# EAGLE design fullboard (EAGLE 9.5.1)

## Sheet 1 of 4: MCU
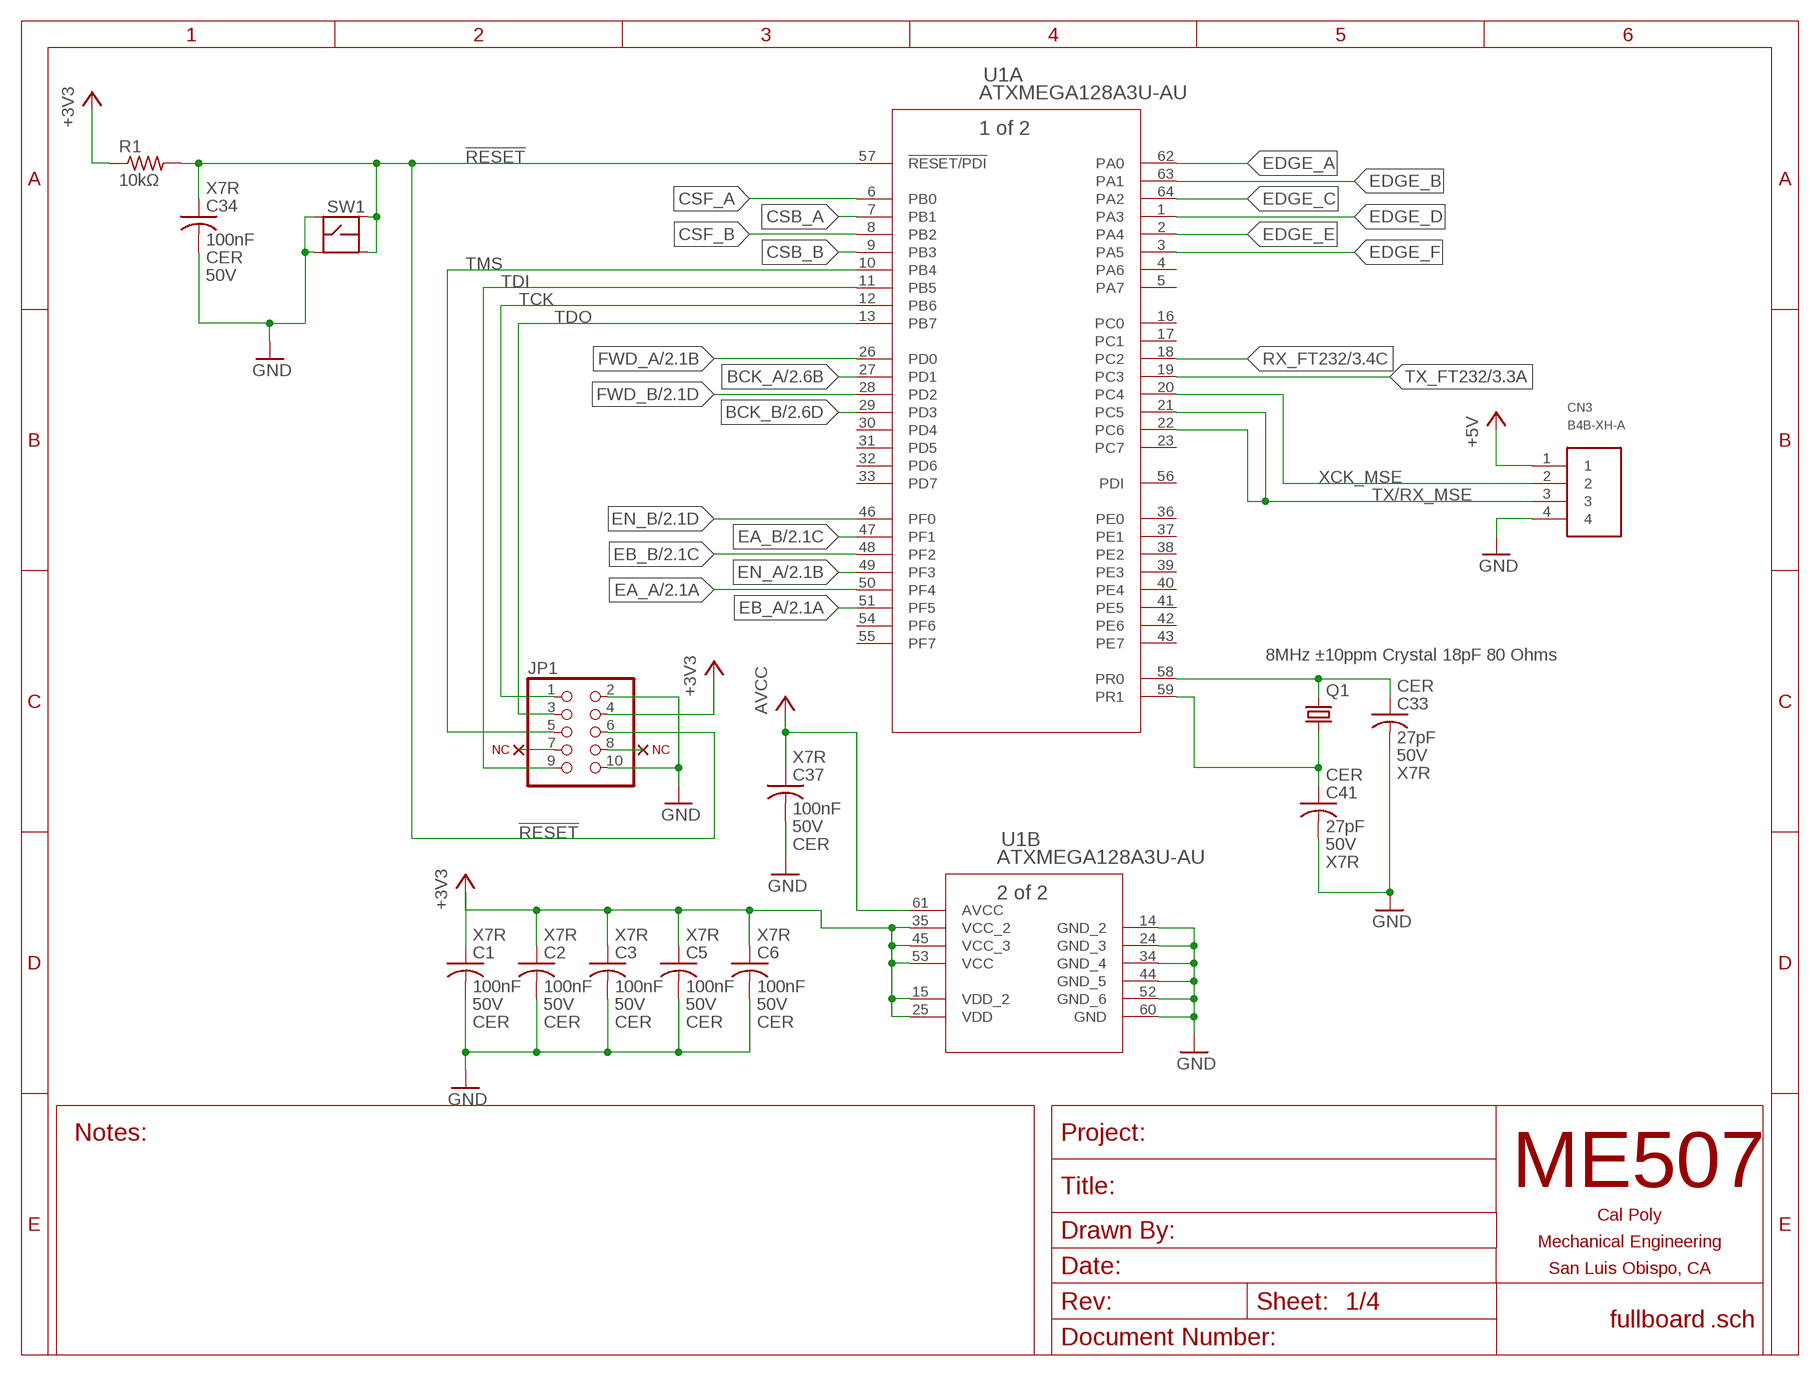
[diagram p0: schematic, sheet 1]

### Parts
C1  100nF  C-USC0805  [C0805]
C2  100nF  C-USC0805  [C0805]
C3  100nF  C-USC0805  [C0805]
C5  100nF  C-USC0805  [C0805]
C6  100nF  C-USC0805  [C0805]
C33  27pF  C-USC0805  [C0805]
C34  100nF  C-USC0805  [C0805]
C37  100nF  C-USC0805  [C0805]
C41  27pF  C-USC0805  [C0805]
CN3  B4B-XH-A  [B4B-XH-A]
JP1  PINHD-2X5  [2X05]
Q1  8MHz ±10ppm Crystal 18pF 80 Ohms  CRYSTALHC49UP  [HC49UP]
R1  10kΩ  R-US_R0805  [R0805]
SW1  TR1-SPST  [TR1]
U1  ATXMEGA128A3U-AU  [64A]
U$1  NC  (no package)
U$2  NC  (no package)

### Nets
!RESET: C34.1 JP1.6 R1.2 SW1.3 SW1.4 U1.57(A:!RESET/PDI)
+3V3: C1.1 C2.1 C3.1 C5.1 C6.1 JP1.4 R1.1 U1.15(B:VDD_2) U1.25(B:VDD) U1.35(B:VCC_2) U1.45(B:VCC_3) U1.53(B:VCC) ; also sheet 2,4
+5V: CN3.1 ; also sheet 4
AVCC: C37.1 U1.61(B:AVCC) ; also sheet 4
BCK_A: U1.27(A:PD1) ; also sheet 2
BCK_B: U1.29(A:PD3) ; also sheet 2
CSB_A: U1.7(A:PB1)
CSB_B: U1.9(A:PB3)
CSF_A: U1.6(A:PB0)
CSF_B: U1.8(A:PB2)
EA_A: U1.50(A:PF4) ; also sheet 2
EA_B: U1.47(A:PF1) ; also sheet 2
EB_A: U1.51(A:PF5) ; also sheet 2
EB_B: U1.48(A:PF2) ; also sheet 2
EDGE_A: U1.62(A:PA0)
EDGE_B: U1.63(A:PA1)
EDGE_C: U1.64(A:PA2)
EDGE_D: U1.1(A:PA3)
EDGE_E: U1.2(A:PA4)
EDGE_F: U1.3(A:PA5)
EN_A: U1.49(A:PF3) ; also sheet 2
EN_B: U1.46(A:PF0) ; also sheet 2
FWD_A: U1.26(A:PD0) ; also sheet 2
FWD_B: U1.28(A:PD2) ; also sheet 2
GND: C1.2 C2.2 C3.2 C5.2 C6.2 C33.2 C34.2 C37.2 C41.2 CN3.4 JP1.2 JP1.10 SW1.1 SW1.2 U1.14(B:GND_2) U1.24(B:GND_3) U1.34(B:GND_4) U1.44(B:GND_5) U1.52(B:GND_6) U1.60(B:GND) ; also sheet 2,3,4
N$6: JP1.7 U$2.D
N$7: JP1.8 U$1.D
RX_FT232: U1.18(A:PC2) ; also sheet 3
TCK: JP1.1 U1.12(A:PB6)
TDI: JP1.9 U1.11(A:PB5)
TDO: JP1.3 U1.13(A:PB7)
TMS: JP1.5 U1.10(A:PB4)
TX/RX_MSE: CN3.3 U1.21(A:PC5) U1.22(A:PC6)
TX_FT232: U1.19(A:PC3) ; also sheet 3
XCK_MSE: CN3.2 U1.20(A:PC4)
XTAL1: C41.1 Q1.2 U1.59(A:PR1)
XTAL2: C33.1 Q1.1 U1.58(A:PR0)
Unconnected: U1.4(A:PA6) U1.5(A:PA7) U1.16(A:PC0) U1.17(A:PC1) U1.23(A:PC7) U1.30(A:PD4) U1.31(A:PD5) U1.32(A:PD6) U1.33(A:PD7) U1.36(A:PE0) U1.37(A:PE1) U1.38(A:PE2) U1.39(A:PE3) U1.40(A:PE4) U1.41(A:PE5) U1.42(A:PE6) U1.43(A:PE7) U1.54(A:PF6) U1.55(A:PF7) U1.56(A:PDI)

## Sheet 2 of 4: Motor drivers
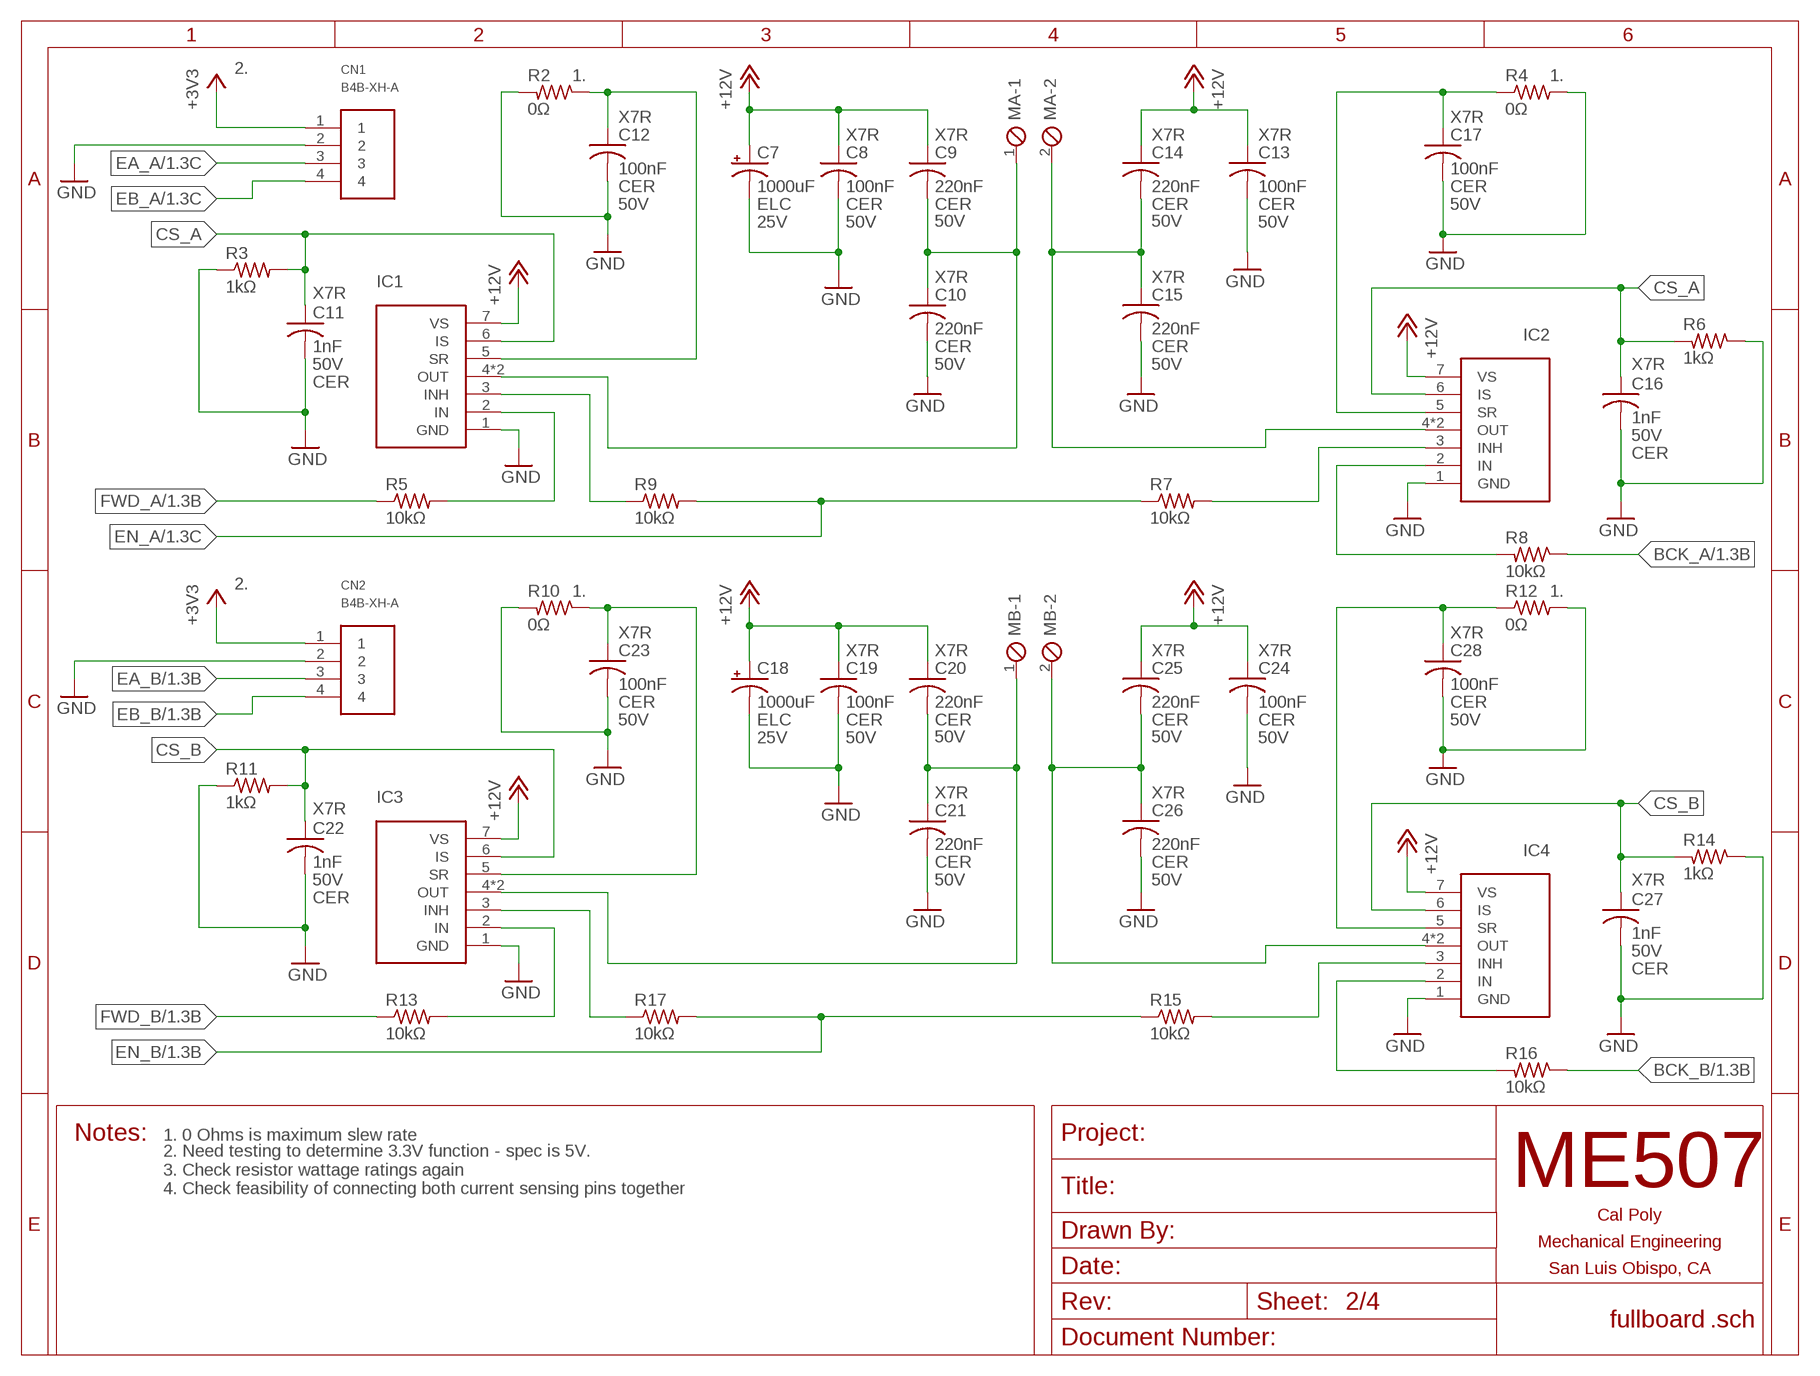
[diagram p1: schematic, sheet 2]
FRAME2 (TITLEBLOCK_LET_L): NOTES: 1. 0 Ohms is maximum slew rate

### Parts
C7  1000uF  CPOL-US  [E5-10]
C8  100nF  C-USC0805  [C0805]
C9  220nF  C-USC0805  [C0805]
C10  220nF  C-USC0805  [C0805]
C11  1nF  C-USC0805  [C0805]
C12  100nF  C-USC0805  [C0805]
C13  100nF  C-USC0805  [C0805]
C14  220nF  C-USC0805  [C0805]
C15  220nF  C-USC0805  [C0805]
C16  1nF  C-USC0805  [C0805]
C17  100nF  C-USC0805  [C0805]
C18  1000uF  CPOL-US  [E5-10]
C19  100nF  C-USC0805  [C0805]
C20  220nF  C-USC0805  [C0805]
C21  220nF  C-USC0805  [C0805]
C22  1nF  C-USC0805  [C0805]
C23  100nF  C-USC0805  [C0805]
C24  100nF  C-USC0805  [C0805]
C25  220nF  C-USC0805  [C0805]
C26  220nF  C-USC0805  [C0805]
C27  1nF  C-USC0805  [C0805]
C28  100nF  C-USC0805  [C0805]
CN1  B4B-XH-A  [B4B-XH-A]
CN2  B4B-XH-A  [B4B-XH-A]
IC1  IFX007T  [TO127P1500X440-7N]
IC2  IFX007T  [TO127P1500X440-7N]
IC3  IFX007T  [TO127P1500X440-7N]
IC4  IFX007T  [TO127P1500X440-7N]
MA  SCREWTERM_2P_508  [2POL508]
MB  SCREWTERM_2P_508  [2POL508]
R2  0Ω  R-US_R0805  [R0805]
R3  1kΩ  R-US_R0805  [R0805]
R4  0Ω  R-US_R0805  [R0805]
R5  10kΩ  R-US_R0805  [R0805]
R6  1kΩ  R-US_R0805  [R0805]
R7  10kΩ  R-US_R0805  [R0805]
R8  10kΩ  R-US_R0805  [R0805]
R9  10kΩ  R-US_R0805  [R0805]
R10  0Ω  R-US_R0805  [R0805]
R11  1kΩ  R-US_R0805  [R0805]
R12  0Ω  R-US_R0805  [R0805]
R13  10kΩ  R-US_R0805  [R0805]
R14  1kΩ  R-US_R0805  [R0805]
R15  10kΩ  R-US_R0805  [R0805]
R16  10kΩ  R-US_R0805  [R0805]
R17  10kΩ  R-US_R0805  [R0805]

### Nets
+3V3: CN1.1 CN2.1 ; also sheet 1,4
+12V: C7.+ C8.1 C9.1 C13.1 C14.1 C18.+ C19.1 C20.1 C24.1 C25.1 IC1.7(VS) IC2.7(VS) IC3.7(VS) IC4.7(VS) ; also sheet 4
BCK_A: R8.1 ; also sheet 1
BCK_B: R16.1 ; also sheet 1
CS_A: C11.1 C16.1 IC1.6(IS) IC2.6(IS) R3.2 R6.2
CS_B: C22.1 C27.1 IC3.6(IS) IC4.6(IS) R11.2 R14.2
EA_A: CN1.3 ; also sheet 1
EA_B: CN2.3 ; also sheet 1
EB_A: CN1.4 ; also sheet 1
EB_B: CN2.4 ; also sheet 1
EN_A: R7.1 R9.2 ; also sheet 1
EN_B: R15.1 R17.2 ; also sheet 1
FWD_A: R5.1 ; also sheet 1
FWD_B: R13.1 ; also sheet 1
GND: C7.- C8.2 C10.2 C11.2 C12.2 C13.2 C15.2 C16.2 C17.2 C18.- C19.2 C21.2 C22.2 C23.2 C24.2 C26.2 C27.2 C28.2 CN1.2 CN2.2 IC1.1(GND) IC2.1(GND) IC3.1(GND) IC4.1(GND) R2.2 R3.1 R4.2 R6.1 R10.2 R11.1 R12.2 R14.1 ; also sheet 1,3,4
MA_1: C9.2 C10.1 IC1.4(OUT) IC1.8(OUT) MA.1
MA_2: C14.2 C15.1 IC2.4(OUT) IC2.8(OUT) MA.2
MB_1: C20.2 C21.1 IC3.4(OUT) IC3.8(OUT) MB.1
MB_2: C25.2 C26.1 IC4.4(OUT) IC4.8(OUT) MB.2
N$2: C12.1 IC1.5(SR) R2.1
N$3: IC2.3(INH) R7.2
N$4: IC2.2(IN) R8.2
N$5: C17.1 IC2.5(SR) R4.1
N$9: IC1.2(IN) R5.2
N$10: C23.1 IC3.5(SR) R10.1
N$11: IC4.2(IN) R16.2
N$12: IC4.3(INH) R15.2
N$13: C28.1 IC4.5(SR) R12.1
N$15: IC3.3(INH) R17.1
N$16: IC3.2(IN) R13.2
N$17: IC1.3(INH) R9.1

### Notes on the sheet
- 2.
- 1. | 1.
- 2.
- 1. | 1.
- 2. Need testing to determine 3.3V function - spec is 5V.
  3. Check resistor wattage ratings again
  4. Check feasibility of connecting both current sensing pins together

## Sheet 3 of 4: USB/UART
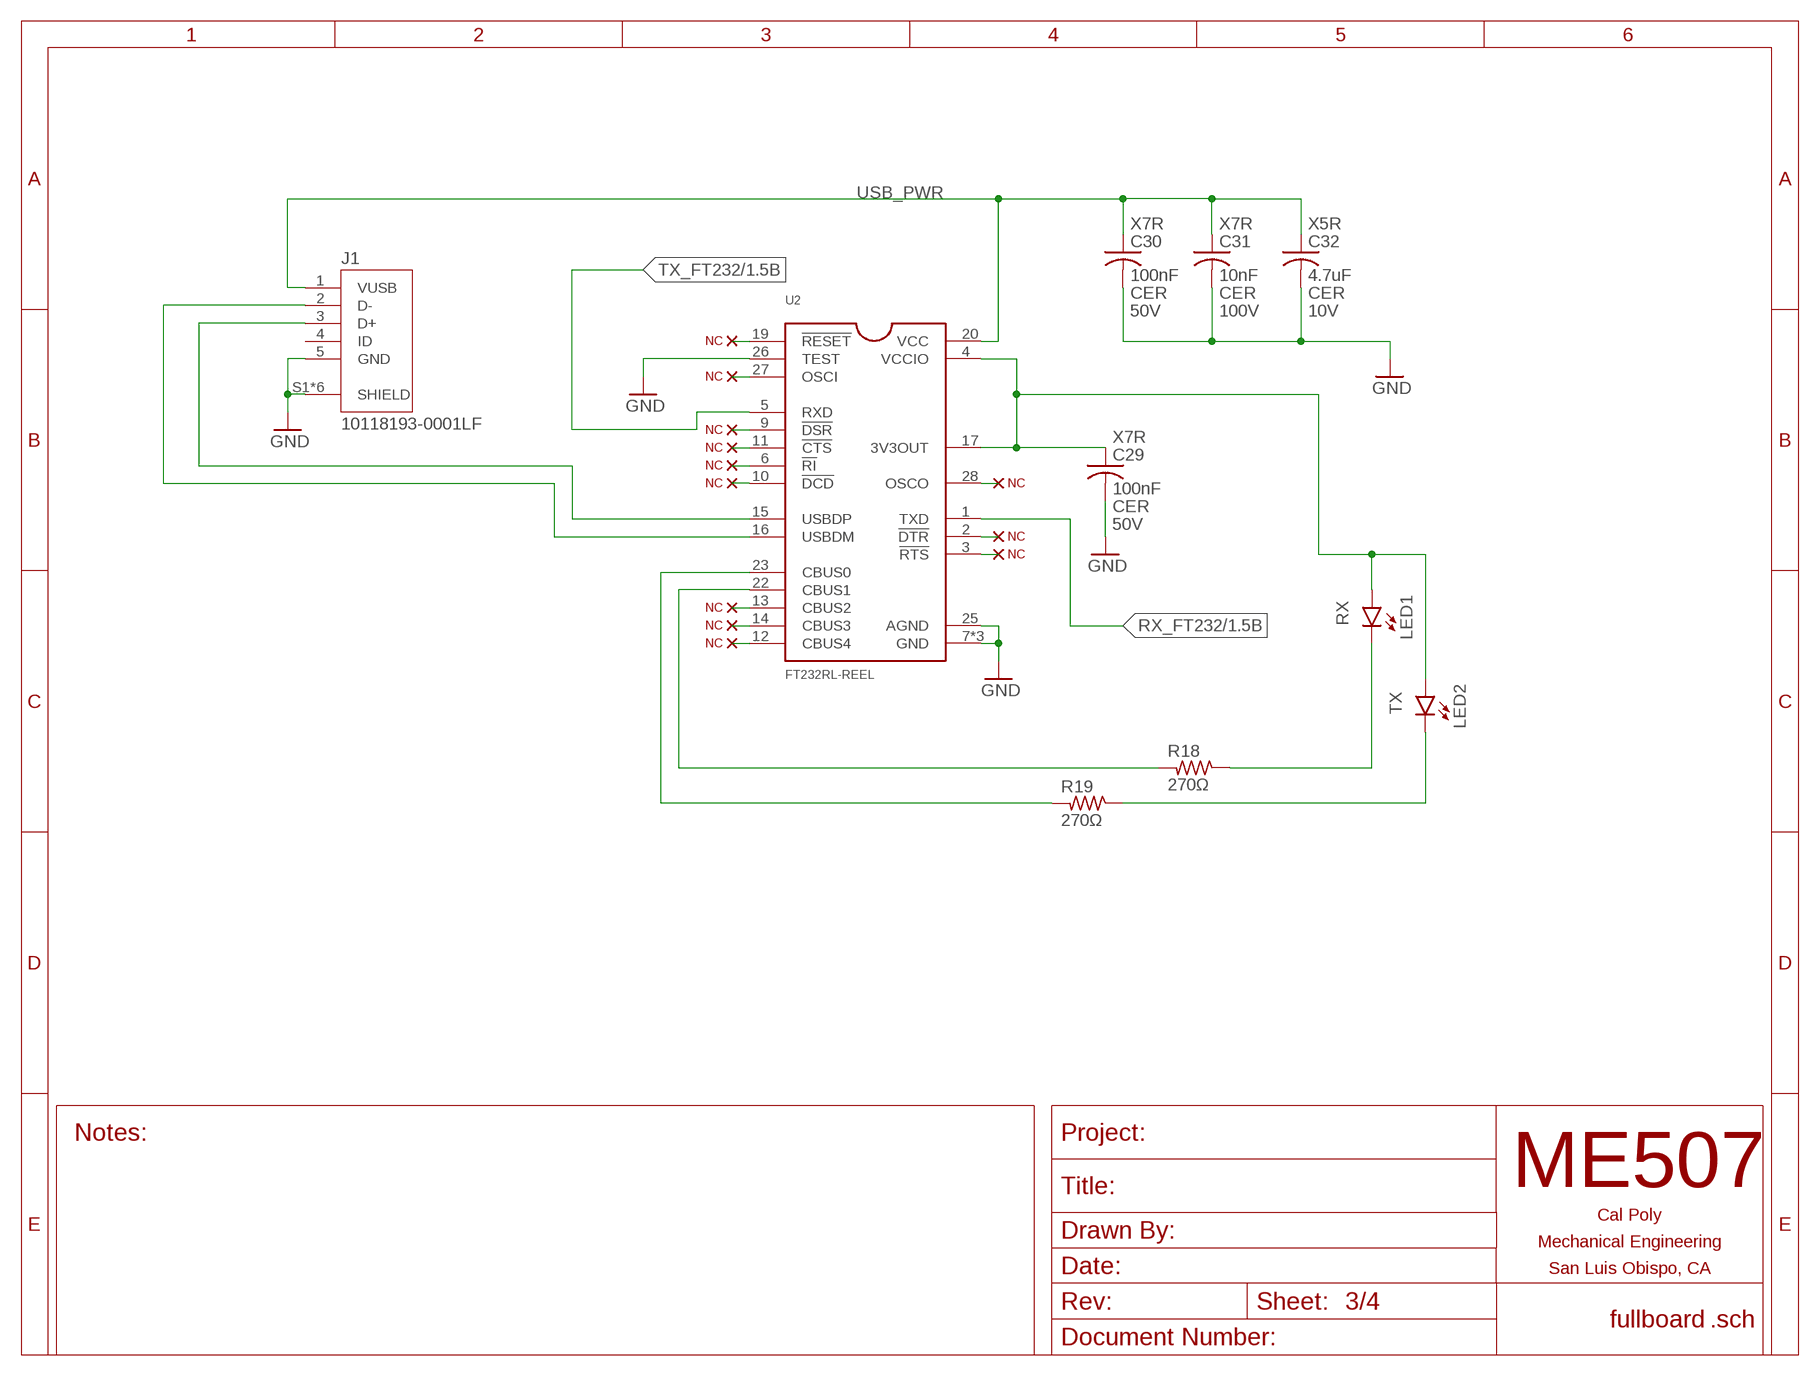
[diagram p2: schematic, sheet 3]

### Parts
C29  100nF  C-USC0805  [C0805]
C30  100nF  C-USC0805  [C0805]
C31  10nF  C-USC0805  [C0805]
C32  4.7uF  C-USC0805  [C0805]
J1  10118193-0001LF  [FCI_10118193-0001LF]
LED1  LEDSML0805  [SML0805]
LED2  LEDSML0805  [SML0805]
R18  270Ω  R-US_R0805  [R0805]
R19  270Ω  R-US_R0805  [R0805]
U2  FT232RL-REEL  [SOP65P780X200-28N]
U$3  NC  (no package)
U$4  NC  (no package)
U$5  NC  (no package)
U$6  NC  (no package)
U$7  NC  (no package)
U$8  NC  (no package)
U$9  NC  (no package)
U$10  NC  (no package)
U$11  NC  (no package)
U$12  NC  (no package)
U$13  NC  (no package)
U$14  NC  (no package)

### Nets
GND: C29.2 C30.2 C31.2 C32.2 J1.5(GND) J1.S1(SHIELD) J1.S2(SHIELD) J1.S3(SHIELD) J1.S4(SHIELD) J1.S5(SHIELD) J1.S6(SHIELD) U2.7(GND) U2.18(GND) U2.21(GND) U2.25(AGND) U2.26(TEST) ; also sheet 1,2,4
N$18: J1.2(D-) U2.16(USBDM)
N$19: J1.3(D+) U2.15(USBDP)
N$20: LED2.C R19.1
N$21: R19.2 U2.23(CBUS0)
N$22: R18.2 U2.22(CBUS1)
N$23: LED1.C R18.1
N$24: U2.27(OSCI) U$13.D
N$25: U2.9(!DSR) U$9.D
N$26: U2.11(!CTS) U$10.D
N$27: U2.28(OSCO) U$3.D
N$28: U2.2(!DTR) U$4.D
N$29: U2.3(!RTS) U$5.D
N$30: U2.13(CBUS2) U$6.D
N$31: U2.14(CBUS3) U$7.D
N$32: U2.12(CBUS4) U$8.D
N$33: U2.6(!RI) U$11.D
N$34: U2.10(!DCD) U$12.D
N$35: U2.19(!RESET) U$14.D
RX_FT232: U2.1(TXD) ; also sheet 1
TX_FT232: U2.5(RXD) ; also sheet 1
USB_PWR: C30.1 C31.1 C32.1 J1.1(VUSB) U2.20(VCC)
VCCIO: C29.1 LED1.A LED2.A U2.4(VCCIO) U2.17(3V3OUT)
Unconnected: J1.4(ID)

## Sheet 4 of 4: Power
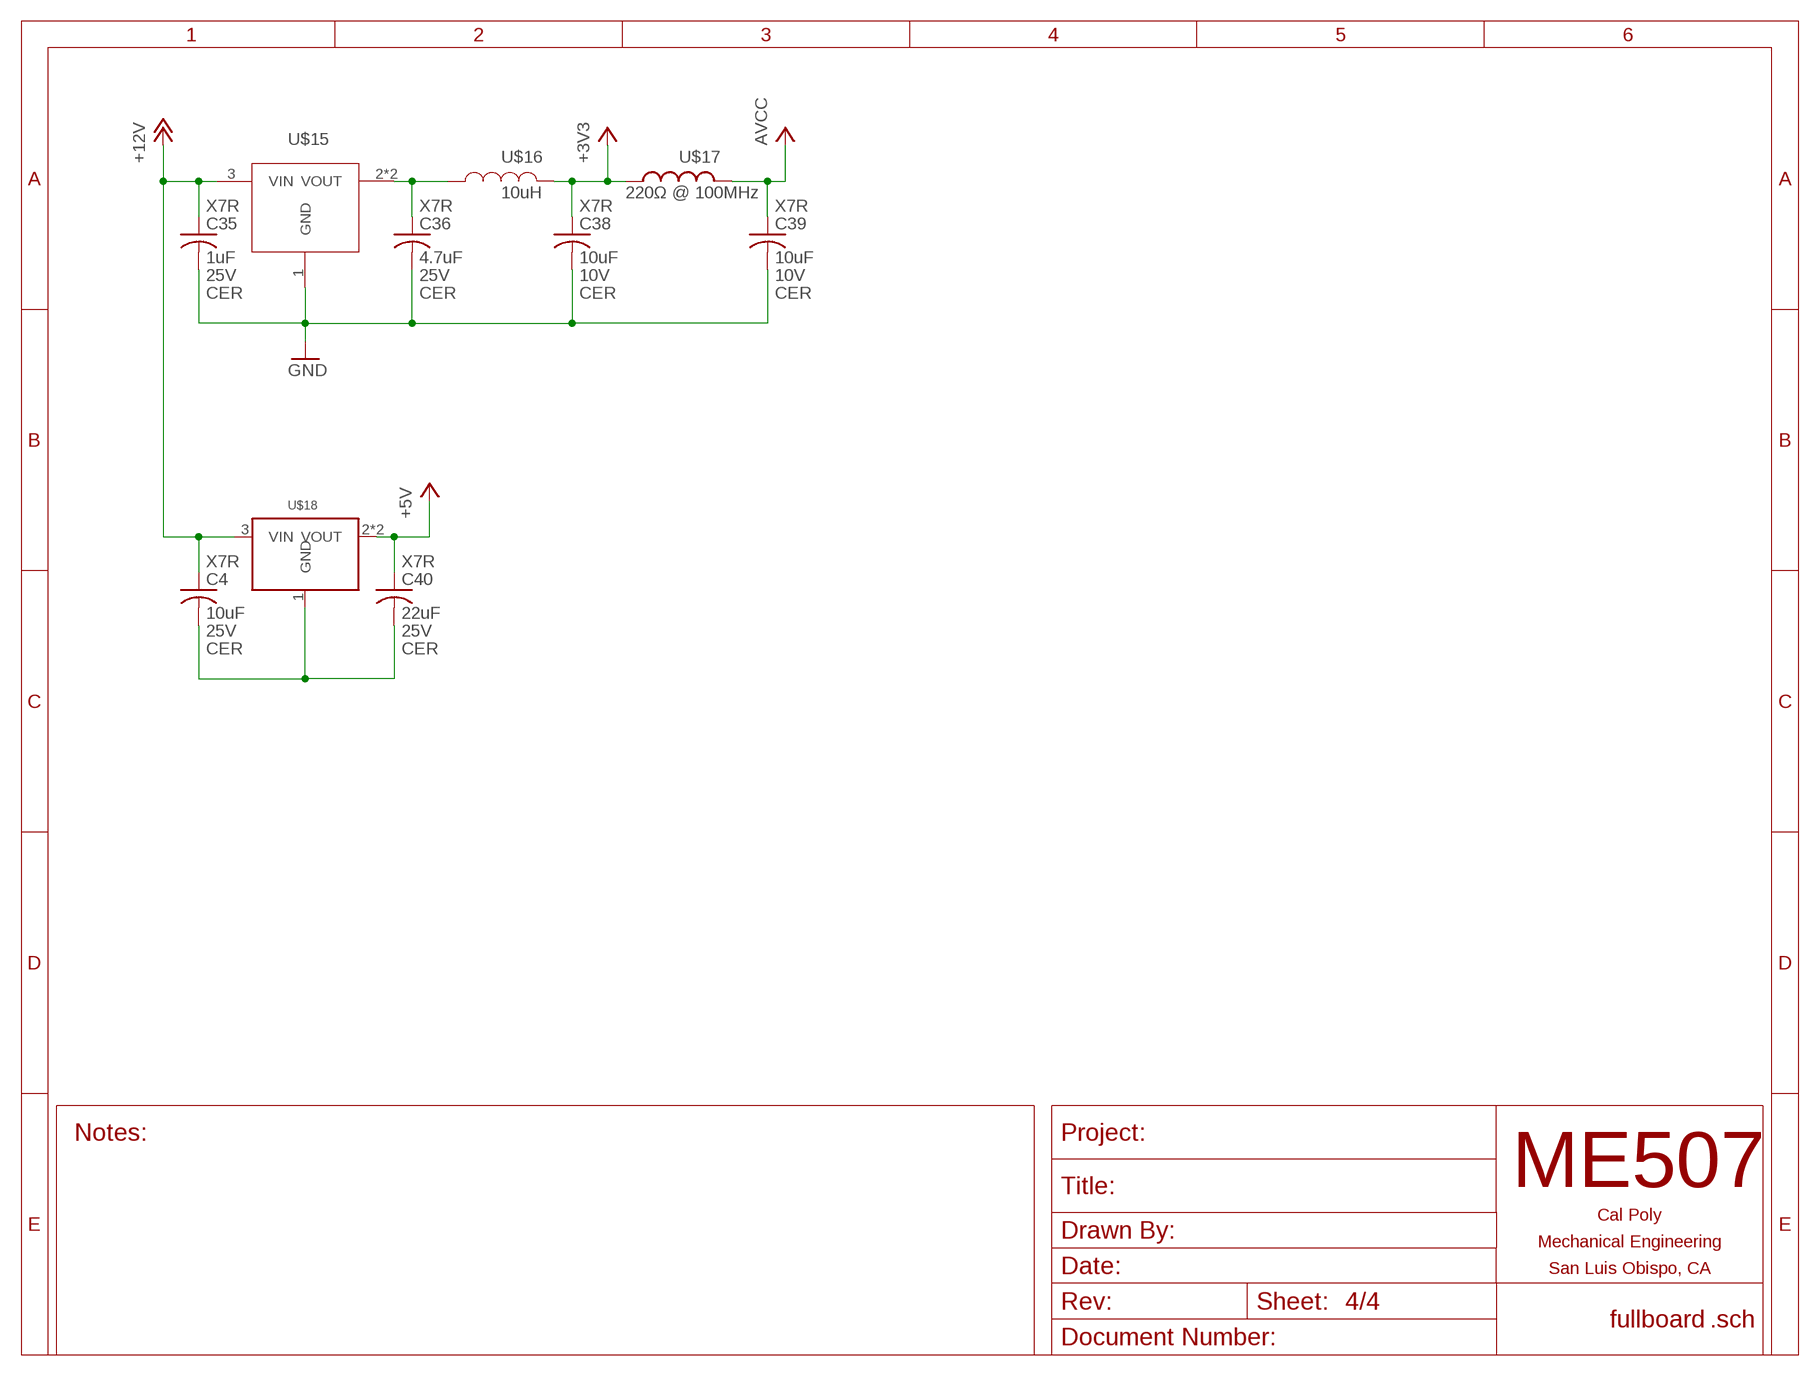
[diagram p3: schematic, sheet 4]

### Parts
C4  10uF  C-USC1206  [C1206]
C35  1uF  C-USC0805  [C0805]
C36  4.7uF  C-USC1206  [C1206]
C38  10uF  C-USC1206  [C1206]
C39  10uF  C-USC1206  [C1206]
C40  22uF  C-USC1210  [C1210]
U$15  LDL1117S33R  [SOT230P700X190-4N]
U$16  RLB0914-100KL  [INDRD580W65D870H1300B]
U$17  BLM21PG221SN1D  [C0805]
U$18  AZ1117IH  [SOT223]

### Nets
+3V3: C38.1 U$16.1 U$17.1 ; also sheet 1,2
+5V: C40.1 U$18.2(VOUT) U$18.4(VOUT) ; also sheet 1
+12V: C4.1 C35.1 U$15.3(VIN) U$18.3(VIN) ; also sheet 2
AVCC: C39.1 U$17.2 ; also sheet 1
GND: C35.2 C36.2 C38.2 C39.2 U$15.1(GND) ; also sheet 1,2,3
N$1: C4.2 C40.2 U$18.1(GND)
N$8: C36.1 U$15.2(VOUT) U$15.4(VOUT) U$16.2

## Library data of the parts
C1-C3 C5 C6 C8 C12 C13 C17 C19 C23 C24 C28-C30 C34 C37 = rcl:C-US: CAPACITOR, American symbol; PN: 1276-1003-1-ND; SPICEPREFIX: C; TR: X7R; TYPE: CER; VR: 50V
C4 = rcl:C-US: CAPACITOR, American symbol; PN: 1276-1804-1-ND; SPICEPREFIX: C; TR: X7R; TYPE: CER; VR: 25V
C7 C18 = SumBot:CPOL-US: POLARIZED CAPACITOR, American symbol; PN: 493-1065-ND; TYPE: ELC; VR: 25V
C9 C10 C14 C15 C20 C21 C25 C26 = rcl:C-US: CAPACITOR, American symbol; PN: 1276-6478-1-ND; SPICEPREFIX: C; TR: X7R; TYPE: CER; VR: 50V
C11 C16 C22 C27 = rcl:C-US: CAPACITOR, American symbol; PN: 311-1127-1-ND; SPICEPREFIX: C; TR: X7R; TYPE: CER; VR: 50V
C31 = rcl:C-US: CAPACITOR, American symbol; PN: 399-17617-1-ND; SPICEPREFIX: C; TR: X7R; TYPE: CER; VR: 100V
C32 = rcl:C-US: CAPACITOR, American symbol; PN: 1276-6464-1-ND; SPICEPREFIX: C; TR: 10V; TYPE: CER; VR: X5R
C33 C41 = rcl:C-US: CAPACITOR, American symbol; PN: 478-11394-1-ND; SPICEPREFIX: C; TR: X7R; TYPE: CER; VR: 50V
C35 = rcl:C-US: CAPACITOR, American symbol; PN: 732-7672-1-ND; SPICEPREFIX: C; TR: X7R; TYP: CER; VR: 25V
C36 = rcl:C-US: CAPACITOR, American symbol; PN: 1276-3177-1-ND; SPICEPREFIX: C; TR: X7R; TYPE: CER; VR: 25V
C38 C39 = rcl:C-US: CAPACITOR, American symbol; PN: 587-6340-1-ND; SPICEPREFIX: C; TR: X7R; TYPE: CER; VR: 10V
C40 = rcl:C-US: CAPACITOR, American symbol; PN: 1276-3391-1-ND; SPICEPREFIX: C; TR: X7R; TYPE: CER; VR: 25V
CN1-CN3 = jst:B4B
IC1-IC4 = SumBot:IFX007T; PN: IFX007TAUMA1
J1 = 10118193-0001LF:10118193-0001LF: Micro USB B Type Receptacle; DESCRIPTION: Conn Micro USB Type B RCP 5 POS 0.65mm Solder RA SMD 5 Terminal 1 Port T/R; DIGI-KEY_PART_NUMBER: 609-4616-1-ND; DIGI-KEY_PURCHASE_URL: https://www.digikey.com/product-detail/en/amphenol-icc-fci/10118193-0001LF/609-4616-1-ND/2785380?utm_source=snapeda&utm_medium=aggregator&utm_campaign=symbol; MF: Amphenol ICC; MP: 10118193-0001LF; PACKAGE: None; PN: 609-4616-1-ND
JP1 = pinhead:PINHD-2X5: PIN HEADER
LED1 = led:LED: LED OSRAM: - CHIPLED LG R971, LG N971, LY N971, LG Q971, LY Q971, LO R971, LY R971 LH N974, LH R974 LS Q976, LO Q976, LY Q976 LO Q996 - Hyper CHIPLED LW Q18S LB Q993, LB Q99A, LB R99A - SideLED LS A670, LO A670, LY A670, LG A670, LP A670 LB A673, LV A673, LT A673, LW A673 LH A674 LY A675 LS A676, LA A676, LO A676, LY A676, LW A676 LS A679, LY A679, LG A679 - Hyper Micro SIDELED® LS Y876, LA Y876, LO Y876, LY Y876 LT Y87S - SmartLED LW L88C, LW L88S LB L89C, LB L89S, LG L890 LS L89K, LO L89K, LY L89K LS L896, LA L896, LO L896, LY L896 - TOPLED LS T670, LO T670, LY T670, LG T670, LP T670 LSG T670, LSP T670, LSY T670, LOP T670, LYG T670 LG T671, LOG T671, LSG T671 LB T673, LV T673, LT T673, LW T673 LH T674 LS T676, LA T676, LO T676, LY T676, LB T676, LH T676, LSB T676, LW T676 LB T67C, LV T67C, LT T67C, LS T67K, LO T67K, LY T67K, LW E67C LS E67B, LA E67B, LO E67B, LY E67B, LB E67C, LV E67C, LT E67C LW T67C LS T679, LY T679, LG T679 LS T770, LO T770, LY T770, LG T770, LP T770 LB T773, LV T773, LT T773, LW T773 LH T774 LS E675, LA E675, LY E675, LS T675 LS T776, LA T776, LO T776, LY T776, LB T776 LHGB T686 LT T68C, LB T68C - Hyper Mini TOPLED® LB M676 - Mini TOPLED Santana® LG M470 LS M47K, LO M47K, LY M47K Source: http://www.osram.convergy.de LUXEON: - LUMILED® LXK2-PW12-R00, LXK2-PW12-S00, LXK2-PW14-U00, LXK2-PW14-V00 LXK2-PM12-R00, LXK2-PM12-S00, LXK2-PM14-U00 LXK2-PE12-Q00, LXK2-PE12-R00, LXK2-PE12-S00, LXK2-PE14-T00, LXK2-PE14-U00 LXK2-PB12-K00, LXK2-PB12-L00, LXK2-PB12-M00, LXK2-PB14-N00, LXK2-PB14-P00, LXK2-PB14-Q00 LXK2-PR12-L00, LXK2-PR12-M00, LXK2-PR14-Q00, LXK2-PR14-R00 LXK2-PD12-Q00, LXK2-PD12-R00, LXK2-PD12-S00 LXK2-PH12-R00, LXK2-PH12-S00 LXK2-PL12-P00, LXK2-PL12-Q00, LXK2-PL12-R00 Source: www.luxeon.com KINGBRIGHT: KA-3528ASYC Source: www.kingbright.com; PN: 732-4984-1-ND; SIG: RX
LED2 = led:LED: LED OSRAM: - CHIPLED LG R971, LG N971, LY N971, LG Q971, LY Q971, LO R971, LY R971 LH N974, LH R974 LS Q976, LO Q976, LY Q976 LO Q996 - Hyper CHIPLED LW Q18S LB Q993, LB Q99A, LB R99A - SideLED LS A670, LO A670, LY A670, LG A670, LP A670 LB A673, LV A673, LT A673, LW A673 LH A674 LY A675 LS A676, LA A676, LO A676, LY A676, LW A676 LS A679, LY A679, LG A679 - Hyper Micro SIDELED® LS Y876, LA Y876, LO Y876, LY Y876 LT Y87S - SmartLED LW L88C, LW L88S LB L89C, LB L89S, LG L890 LS L89K, LO L89K, LY L89K LS L896, LA L896, LO L896, LY L896 - TOPLED LS T670, LO T670, LY T670, LG T670, LP T670 LSG T670, LSP T670, LSY T670, LOP T670, LYG T670 LG T671, LOG T671, LSG T671 LB T673, LV T673, LT T673, LW T673 LH T674 LS T676, LA T676, LO T676, LY T676, LB T676, LH T676, LSB T676, LW T676 LB T67C, LV T67C, LT T67C, LS T67K, LO T67K, LY T67K, LW E67C LS E67B, LA E67B, LO E67B, LY E67B, LB E67C, LV E67C, LT E67C LW T67C LS T679, LY T679, LG T679 LS T770, LO T770, LY T770, LG T770, LP T770 LB T773, LV T773, LT T773, LW T773 LH T774 LS E675, LA E675, LY E675, LS T675 LS T776, LA T776, LO T776, LY T776, LB T776 LHGB T686 LT T68C, LB T68C - Hyper Mini TOPLED® LB M676 - Mini TOPLED Santana® LG M470 LS M47K, LO M47K, LY M47K Source: http://www.osram.convergy.de LUXEON: - LUMILED® LXK2-PW12-R00, LXK2-PW12-S00, LXK2-PW14-U00, LXK2-PW14-V00 LXK2-PM12-R00, LXK2-PM12-S00, LXK2-PM14-U00 LXK2-PE12-Q00, LXK2-PE12-R00, LXK2-PE12-S00, LXK2-PE14-T00, LXK2-PE14-U00 LXK2-PB12-K00, LXK2-PB12-L00, LXK2-PB12-M00, LXK2-PB14-N00, LXK2-PB14-P00, LXK2-PB14-Q00 LXK2-PR12-L00, LXK2-PR12-M00, LXK2-PR14-Q00, LXK2-PR14-R00 LXK2-PD12-Q00, LXK2-PD12-R00, LXK2-PD12-S00 LXK2-PH12-R00, LXK2-PH12-S00 LXK2-PL12-P00, LXK2-PL12-Q00, LXK2-PL12-R00 Source: www.luxeon.com KINGBRIGHT: KA-3528ASYC Source: www.kingbright.com; PN: 732-4984-1-ND; SIG: TX
MA MB = ME507:SCREWTERM_2P: PHOENIX CONNECTOR; PN: 277-17493-ND
Q1 = crystal:CRYSTAL: CRYSTAL; OC_FARNELL: unknown; OC_NEWARK: unknown; PN: 887-1263-1-ND
R1 R5 R7-R9 R13 R15-R17 = rcl:R-US_: RESISTOR, American symbol; PN: 311-10.0KCRCT-ND; SPICEPREFIX: R
R2 R4 R10 R12 = rcl:R-US_: RESISTOR, American symbol; PN: RMCF0805ZT0R00CT-ND; SPICEPREFIX: R
R3 R6 R11 R14 = rcl:R-US_: RESISTOR, American symbol; PN: 311-1.00KCRCT-ND; SPICEPREFIX: R
R18 R19 = rcl:R-US_: RESISTOR, American symbol; PN: RHM270KCT-ND; SPICEPREFIX: R
SW1 = SumBot:TR1-SPST; PN: 563-1932-5-ND
U1 = SumBot:ATXMEGA128A3U-AU; MANUFACTURER_PART_NUMBER: ATXMEGA128A3UAU; PN: ATXMEGA128A3U-AU-ND; VENDOR: Atmel
U2 = FT232RL-REEL:FT232RL-REEL: USB to serial UART interface; DESCRIPTION: USB Full Speed to Serial UART IC, Includes Oscillator and EEPROM - SSOP-28; DIGI-KEY_PART_NUMBER: 768-1007-1-ND; DIGI-KEY_PURCHASE_URL: https://www.digikey.com/product-detail/en/ftdi-future-technology-devices-international-ltd/FT232RL-REEL/768-1007-1-ND/1836402?utm_source=snapeda&utm_medium=aggregator&utm_campaign=symbol; MF: FTDI,; MP: FT232RL-REEL; PACKAGE: SSOP-28 FTDI; PN: 768-1007-1-ND
U$1-U$14 = ME507:NC
U$15 = SumBot:LDL1117S33R; PN: 497-17239-1-ND
U$16 = SumBot:RLB0914-100KL; PN: RLB0914-100KL-ND; RATING: 10uH
U$17 = blm21:BLM21PG221SN1D; PN: 490-1054-1-ND; RATING: 220Ω @ 100MHz
U$18 = SumBot:AZ1117IH; PN: AZ1117IH-5.0TRG1DICT-ND

## Board
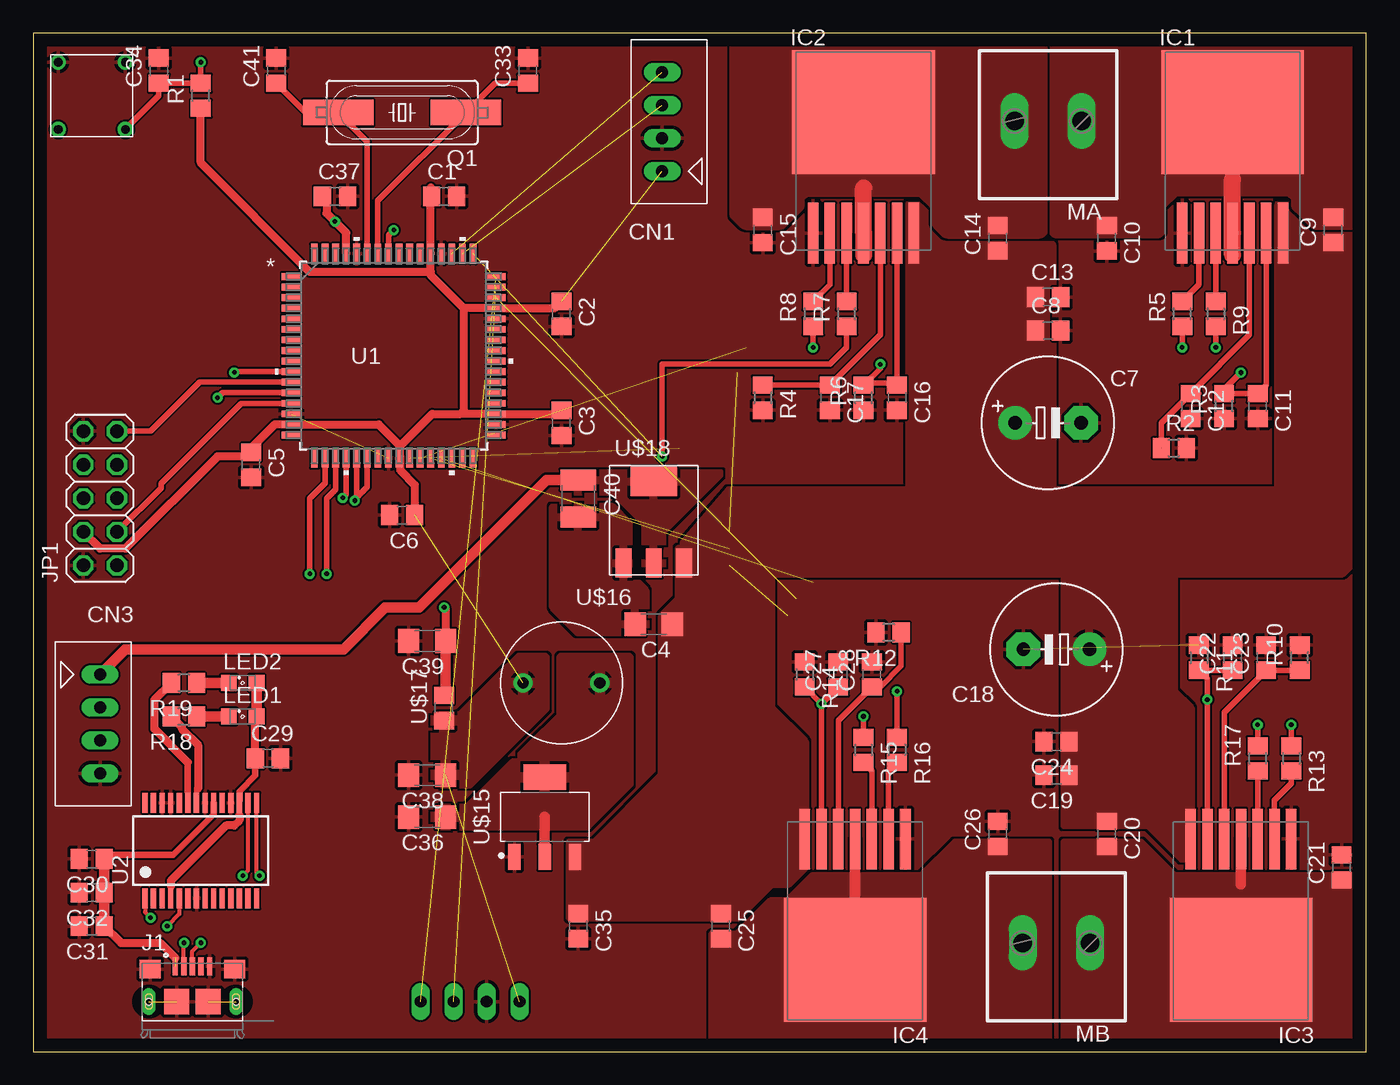
[diagram p4: board, top side]
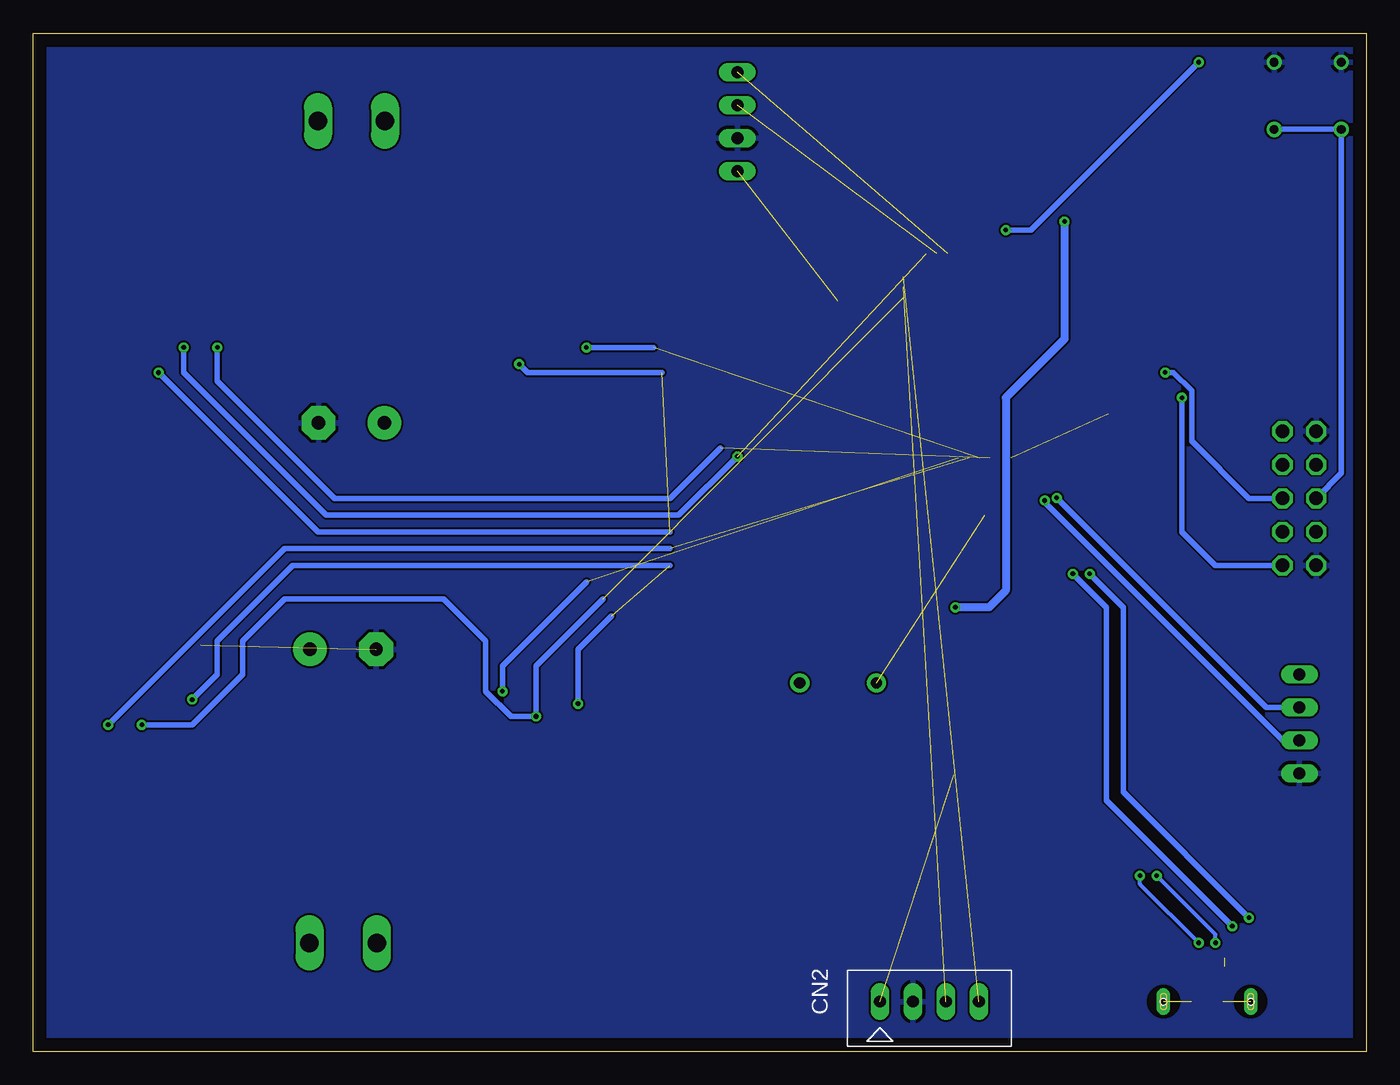
[diagram p5: board, bottom side, seen from below]

Size 100.94 x 77.14 mm. Coordinates in mm from the lower left corner, seen from the top.
Outline: 0,0 100.94,0 100.94,77.14 0,77.14 0,0
Copper layers (1*16): Top 0.035mm / dielectric 1.5mm / Bottom 0.035mm
Design rules "default": minimum track width 6mil, minimum drill 0.35mm, track to track 6mil, track to pad 6mil, pad to pad 6mil, via to via 6mil, smd to smd 6mil, copper to edge 40mil, drill to drill 6mil, minimum pad ring 10mil, minimum via ring 8mil, stop-mask expansion 4mil, vias tented up to drill 0mil, thermal gap 10mil

### Footprints (pad centres in the part's own frame; a part is rotated, then mirrored left to right if it is on the bottom)
C0805 = smd 1.3 x 1.5: 1 -0.95,0; 2 0.95,0
C1206 = smd 1.6 x 1.8: 1 -1.4,0; 2 1.4,0
E5-10 = drill 1.016 pad 2.54: + -2.5,0 | drill 1.016 pad 2.54 octagon: - 2.5,0
C1210 = smd 1.6 x 2.7: 1 -1.4,0; 2 1.4,0
B4B-XH-A = drill 0.9 long: 1 0,0; 2 -2.5,0; 3 -5,0; 4 -7.5,0
TO127P1500X440-7N = smd 0.8 x 4.6: 1 -3.81,2.3; 2 -2.54,2.3; 3 -1.27,2.3; 4 0,2.3; 5 1.27,2.3; 6 2.54,2.3; 7 3.81,2.3 | smd 10.8 x 9.4: 8 0,11.45
FCI_10118193-0001LF = smd 0.4 x 1.35: 1 -1.3,2.675; 2 -0.65,2.675; 3 0,2.675; 4 0.65,2.675; 5 1.3,2.675 | smd 1.6 x 1.4: S1 -3.2,2.45; S2 3.2,2.45 | smd 1.9 x 1.9: S3 1.2,0; S4 -1.2,0 | drill 0.5 pad 0.9 long: S5 -3.3,0; S6 3.3,0 | hole 0.5: -3.3,0; 3.3,0
2X05 = drill 1.016 octagon: 1 -5.08,-1.27; 2 -5.08,1.27; 3 -2.54,-1.27; 4 -2.54,1.27; 5 0,-1.27; 6 0,1.27; 7 2.54,-1.27; 8 2.54,1.27; 9 5.08,-1.27; 10 5.08,1.27
SML0805 = smd 1.2 x 1.2: A 1.05,0; C -1.05,0
2POL508 = drill 1.4 long: 1 -2.54,0; 2 2.54,0
HC49UP = smd 5.334 x 1.93: 1 -4.826,0; 2 4.826,0
R0805 = smd 1.3 x 1.5: 1 -0.95,0; 2 0.95,0
TR1 = drill 0.65: 1 2.54,-2.54; 2 2.54,2.54; 3 -2.54,2.54; 4 -2.54,-2.54
64A = smd 1.462 x 0.517: 1 -7.747,6; 2 -7.747,5.2; 3 -7.747,4.4; 4 -7.747,3.6; 5 -7.747,2.8; 6 -7.747,2; 7 -7.747,1.2; 8 -7.747,0.4; 9 -7.747,-0.4; 10 -7.747,-1.2; 11 -7.747,-2; 12 -7.747,-2.8; 13 -7.747,-3.6; 14 -7.747,-4.4; 15 -7.747,-5.2; 16 -7.747,-6; 33 7.747,-6; 34 7.747,-5.2; 35 7.747,-4.4; 36 7.747,-3.6; 37 7.747,-2.8; 38 7.747,-2; 39 7.747,-1.2; 40 7.747,-0.4; 41 7.747,0.4; 42 7.747,1.2; 43 7.747,2; 44 7.747,2.8; 45 7.747,3.6; 46 7.747,4.4; 47 7.747,5.2; 48 7.747,6 | smd 0.517 x 1.462: 17 -6,-7.747; 18 -5.2,-7.747; 19 -4.4,-7.747; 20 -3.6,-7.747; 21 -2.8,-7.747; 22 -2,-7.747; 23 -1.2,-7.747; 24 -0.4,-7.747; 25 0.4,-7.747; 26 1.2,-7.747; 27 2,-7.747; 28 2.8,-7.747; 29 3.6,-7.747; 30 4.4,-7.747; 31 5.2,-7.747; 32 6,-7.747; 49 6,7.747; 50 5.2,7.747; 51 4.4,7.747; 52 3.6,7.747; 53 2.8,7.747; 54 2,7.747; 55 1.2,7.747; 56 0.4,7.747; 57 -0.4,7.747; 58 -1.2,7.747; 59 -2,7.747; 60 -2.8,7.747; 61 -3.6,7.747; 62 -4.4,7.747; 63 -5.2,7.747; 64 -6,7.747
SOP65P780X200-28N = smd 1.5 x 0.4: 1 -3.625,4.225; 2 -3.625,3.575; 3 -3.625,2.925; 4 -3.625,2.275; 5 -3.625,1.625; 6 -3.625,0.975; 7 -3.625,0.325; 8 -3.625,-0.325; 9 -3.625,-0.975; 10 -3.625,-1.625; 11 -3.625,-2.275; 12 -3.625,-2.925; 13 -3.625,-3.575; 14 -3.625,-4.225; 15 3.625,-4.225; 16 3.625,-3.575; 17 3.625,-2.925; 18 3.625,-2.275; 19 3.625,-1.625; 20 3.625,-0.975; 21 3.625,-0.325; 22 3.625,0.325; 23 3.625,0.975; 24 3.625,1.625; 25 3.625,2.275; 26 3.625,2.925; 27 3.625,3.575; 28 3.625,4.225
SOT230P700X190-4N = smd 1.965 x 0.934: 1 -3.023,2.3; 2 -3.023,0; 3 -3.023,-2.3 | smd 1.965 x 3.234: 4 3.023,0
INDRD580W65D870H1300B = drill 0.85 pad 1.45: 1 -2.9,0; 2 2.9,0
SOT223 = smd 1.2 x 2.2: 1 -2.3,-1.1; 2 0,-1.1; 3 2.3,-1.1 | smd 3.5 x 2.2: 4 0,5.1

### Placement (x,y rotation side)
C1  31.11,64.77 0 top
C2  40.01,55.88 270 top
C3  40.01,47.62 270 top
C4  46.99,32.39 180 top
C5  16.51,44.45 270 top
C6  27.94,40.64 180 top
C7  76.83,47.62 0 top
C8  76.83,54.61 0 top
C9  98.42,62.23 90 top
C10  81.28,61.59 270 top
C11  92.71,48.9 270 top
C12  87.63,48.9 270 top
C13  76.83,57.15 0 top
C14  73.03,61.59 90 top
C15  55.24,62.23 270 top
C16  65.41,49.53 270 top
C17  60.33,49.53 270 top
C18  77.47,30.48 180 top
C19  77.47,20.95 180 top
C20  81.28,16.51 270 top
C21  99.06,13.97 90 top
C22  90.81,29.84 90 top
C23  93.34,29.84 90 top
C24  77.47,23.49 180 top
C25  52.07,9.53 270 top
C26  73.03,16.51 90 top
C27  60.96,28.57 90 top
C28  63.5,28.57 90 top
C29  17.78,22.22 0 top
C30  4.45,14.61 180 top
C31  4.45,9.53 180 top
C32  4.45,12.06 180 top
C33  37.47,74.3 90 top
C34  9.53,74.3 90 top
C35  41.27,9.53 270 top
C36  29.84,17.78 180 top
C37  22.86,64.77 0 top
C38  29.84,20.95 180 top
C39  29.84,31.11 180 top
C40  41.27,41.91 270 top
C41  18.41,74.3 90 top
CN1  47.62,66.67 270 top
CN2  36.83,3.81 180 bottom
CN3  5.08,28.57 90 top
IC1  90.81,59.69 0 top
IC2  62.87,59.69 0 top
IC3  91.44,18.41 180 top
IC4  62.23,18.41 180 top
J1  12.06,3.81 0 top
JP1  5.08,41.91 90 top
LED1  15.88,25.4 0 top
LED2  15.88,27.94 0 top
MA  76.83,70.48 180 top
MB  77.47,8.26 180 top
Q1  27.94,71.12 180 top
R1  12.7,72.39 90 top
R2  86.36,45.72 0 top
R3  90.17,48.9 90 top
R4  55.24,49.53 270 top
R5  87,55.88 90 top
R6  62.87,49.53 90 top
R7  61.59,55.88 90 top
R8  59.05,55.88 90 top
R9  89.53,55.88 270 top
R10  95.89,29.84 90 top
R11  88.27,29.84 270 top
R12  64.77,31.75 180 top
R13  95.25,22.22 270 top
R14  58.42,28.57 270 top
R15  62.87,22.86 270 top
R16  65.41,22.86 270 top
R17  92.71,22.22 90 top
R18  11.43,25.4 180 top
R19  11.43,27.94 180 top
SW1  4.45,72.39 90 top
U1  27.3,52.71 0 top
U2  12.7,15.24 90 top
U$15  38.73,17.78 90 top
U$16  40.01,27.94 0 top
U$17  31.11,26.04 90 top
U$18  46.99,38.1 0 top

### Tracks (layer width: path | path; a pad name or v marks a point on that pad's centre or on a via)
!RESET  (via drill 0.35)
  Top 0.406: U1.57 26.91,61.83 v27.3,62.23 | SW1.4 9.53,72.39 C34.1 R1.2 | R1.2 | v12.7,74.93 R1.2
  Bottom 0.406: SW1.4 SW1.3 1.91,43.82 JP1.6 | v27.3,62.23 25.4,62.23 v12.7,74.93
+3V3  (3 unrouted)
  Top 0.61: C6.1 28.89,42.94 27.79,44.04 27.79,44.87 U1.25 27.79,45.04 27.79,45.88 | C3.1 39.73,48.3 U1.35 32.38,48.3 | C2.1 39.48,56.3 U1.45 32.59,56.3 | 30.11,64.71 U1.53 30.11,59.05 | 30.11,64.71 C1.1 | 30.11,65.46 30.11,64.71 | JP1.4 5.08,38.1 6.99,38.1 13.97,45.09 16.2,45.09 C5.1 16.19,45.72 16.51,45.72 18.3,47.51 U1.15 26.16,47.51 27.79,45.88 | 30.11,59.05 30.11,58.8 32.59,56.3 | 27.79,45.88 30.22,48.3 32.38,48.3 | 32.59,56.3 32.59,48.52 32.38,48.3 | 30.11,59.05 20.95,59.05 12.7,67.31 R1.1
  Top 0.813: 31.11,21.08 C38.1
  pour Top: 30.48,20.32 30.48,25.4 31.75,25.4 32.38,25.4 35.56,28.57 36.83,29.84 37.47,29.84 38.73,29.84 38.73,26.04 33.02,20.32
+5V
  Top 0.813: C40.1 38.87,43.31 29.21,33.66 26.67,33.66 23.5,30.48 6.99,30.48 CN3.1
  pour Top: 46.35,36.2 46.35,40.01 43.97,42.39 40.01,42.39 40.01,43.82 52.07,43.82 47.62,39.37 47.62,36.2
+12V
  pour Top (rank 3, no thermals): 66.67,64.13 69.22,61.59 76.2,61.59 76.83,60.96 76.83,42.55 66.67,42.55
  pour Top (rank 3, no thermals): 94.61,64.13 96.52,62.23 102.87,62.23 102.23,61.59 102.23,41.91 94.61,41.91
  pour Top (no thermals): 40.64,15.88 42.55,15.88 47.62,20.95 47.62,33.02 48.9,34.29 48.9,38.1 55.88,38.1 55.88,26.04 58.42,23.49 58.42,13.97 57.15,12.7 55.88,12.7 53.34,10.16 40.64,10.16
  pour Top (no thermals): 78.11,17.14 78.11,31.11 86.36,31.11 86.36,27.3 87.63,26.04 87.63,14.61 87,14.61 84.45,17.14
  pour Top: 52.7,36.2 48.9,36.2 48.9,38.1 52.7,42.55 100.33,42.55 100.33,37.47 99.06,36.2 86.36,36.2 86.36,31.11 78.11,31.11 78.11,36.2
AVCC  (via drill 0.35)
  Top 0.61: C37.1 22.23,64.45 22.23,63.5 v22.86,62.87 23.7,62.02 U1.61 | v31.11,33.66 31.25,33.52 C39.1
  Top 0.813: C39.1 31.25,27.11 U$17.2
  Bottom 0.61: v31.11,33.66 28.57,33.66 27.3,34.93 27.3,49.53 22.86,53.98 v22.86,62.87
BCK_A  (via drill 0.35)  (1 unrouted)
  Top 0.406: R8.1 v59.05,53.34
  Bottom 0.406: v59.05,53.34 53.98,53.34
BCK_B  (via drill 0.35)  (1 unrouted)
  Top 0.406: R16.1 v65.41,27.3
  Bottom 0.406: v65.41,27.3 65.41,29.21 59.05,35.56
CS_A  (via drill 0.35)  (1 unrouted)
  Top 0.406: IC1.6 93.34,50.48 C11.1 R3.2 | 90.81,49.84 R3.2 | IC2.6 C16.1 65.25,50.64 63.02,50.64 R6.2 64.14,51.75 v64.14,52.07 | R3.2 90.17,50.16 v91.44,51.44
  Bottom 0.406: v64.14,52.07 63.5,51.44 53.34,51.44 | v91.44,51.44 79.38,39.37 52.7,39.37
CS_B  (via drill 0.35)  (1 unrouted)
  Top 0.406: C22.1 R11.2 88.9,28.26 v88.9,26.67 IC3.6 | v59.69,26.35 C27.1 | v59.69,26.35 R14.2 | IC4.6 v59.69,26.35
  Bottom 0.406: v59.69,26.35 59.69,30.48 57.15,33.02 | v88.9,26.67 87,28.57 87,31.11 81.28,36.83 52.7,36.83
EA_A  (1 unrouted)
EA_B  (1 unrouted)
EB_A  (1 unrouted)
EB_B  (1 unrouted)
EN_A  (via drill 0.35)  (1 unrouted)
  Top 0.406: R7.1 61.59,53.34 60.33,52.07 47.62,52.07 v47.62,45.09 | R9.2 v89.53,53.34
  Bottom 0.406: v89.53,53.34 89.53,51.44 78.74,40.64 52.07,40.64 v47.62,45.09
EN_B  (via drill 0.35)  (1 unrouted)
  Top 0.406: R17.2 v92.71,24.76 | R15.1 v62.87,25.4
  Bottom 0.406: 57.78,34.29 62.87,29.21 v62.87,25.4 64.77,25.4 66.67,27.3 66.67,31.11 69.85,34.29 81.92,34.29 85.09,31.11 85.09,28.57 88.9,24.76 v92.71,24.76
FWD_A  (via drill 0.35)  (1 unrouted)
  Top 0.406: R5.1 v87,53.34
  Bottom 0.406: v87,53.34 87,50.8 78.11,41.91 52.7,41.91 48.9,45.72
FWD_B  (via drill 0.35)  (1 unrouted)
  Top 0.406: v95.25,24.76 R13.1
  Bottom 0.406: v95.25,24.76 81.92,38.1 52.7,38.1
GND  (4 unrouted)
  pour Top (rank 5): -5.08,106.05 -5.08,-10.79 -5,-10.72 167.37,-10.72 167.37,108.58 -3.81,108.58
  pour Bottom (rank 5): -5.71,82.55 104.78,82.55 105.41,83.18 105.41,-9.53 104.78,-10.16 -4.45,-10.16 -5.71,-8.89
MA_1
  Top 1.27: 90.81,60.33 IC1.4 90.81,66.04
  pour Top (rank 2, no thermals): 77.47,76.83 101.6,76.83 101.6,64.13 100.33,62.87 97.16,62.87 95.89,64.13 95.89,64.77 95.25,65.41 86.36,65.41 85.09,64.13 85.09,62.23 77.47,62.23
MA_2
  Top 1.27: 62.87,65.41 IC2.4 62.87,60.33
  pour Top (no thermals): 53.98,62.87 56.52,62.87 57.78,64.13 57.78,64.77 58.42,65.41 67.31,65.41 68.58,64.13 68.58,62.87 69.22,62.23 76.2,62.23 76.2,76.83 53.34,76.83 53.34,63.5
MB_1
  Top 0.813: IC3.4 91.44,12.7
  pour Top (no thermals): 78.11,15.88 83.82,15.88 86.36,13.34 102.23,13.34 102.23,-1.27 100.97,-2.54 79.38,-2.54 78.11,-1.27
MB_2
  Top 0.813: IC4.4 62.23,11.43
  pour Top (no thermals): 51.44,8.89 53.34,8.89 55.88,11.43 57.15,11.43 59.05,13.34 67.31,13.34 69.85,15.88 76.83,15.88 76.83,-1.27 51.44,-1.27
N$1
  pour Top: 39.37,33.66 39.37,41.27 43.81,41.27 45.09,40.01 45.09,36.2 46.35,34.93 46.35,31.75 41.27,31.75
N$2  (1 unrouted)
  Top 0.406: IC1.5 92.08,54.29 C12.1 | 88.27,49.84 C12.1 | C12.1 86.74,48.95 86.73,48.95 85.41,47.62 R2.1
N$3
  Top 0.406: IC2.3 R7.2
N$4
  Top 0.406: IC2.2 60.33,58.1 R8.2
N$5
  Top 0.406: IC2.5 64.14,54.29 C17.1 R4.1
N$8
  Top 0.813: U$15.2 38.73,17.78
  pour Top: 30.48,18.41 32.89,18.41 40.01,25.4 40.01,29.84 45.09,29.84 45.09,20.32 41.91,17.14 30.48,17.14
N$9
  Top 0.406: IC1.2 88.27,58.1 R5.2
N$10
  Top 0.406: IC3.5 90.17,25.72 C23.1 R10.1
N$11
  Top 0.406: R16.2 64.77,21.27 IC4.2
N$12
  Top 0.406: R15.2 63.5,21.27 IC4.3
N$13
  Top 0.406: IC4.5 60.96,25.08 C28.1 64.14,27.62 | 64.14,27.62 64.13,27.62 | R12.1 65.72,29.21 64.14,27.62
N$15
  Top 0.406: IC3.3 R17.1
N$16
  Top 0.406: IC3.2 93.98,19.05 95.25,20.32 R13.2
N$17
  Top 0.406: IC1.3 R9.1
N$18  (via drill 0.35)
  Top 0.305: J1.2 11.41,8.24 v11.43,8.26 | v15.88,13.34 16.27,13.73 U2.16
  Bottom 0.305: v15.88,13.34 11.43,8.89 v11.43,8.26
N$19  (via drill 0.35)
  Top 0.305: J1.3 12.06,7.62 v12.7,8.26 | v17.14,13.34 16.93,13.55 U2.15
  Bottom 0.305: v12.7,8.26 17.14,12.7 v17.14,13.34
N$20
  Top 0.813: LED2.C R19.1
N$21
  Top 0.406: U2.23 11.72,19.68
  Top 0.508: 11.72,19.68 11.72,21.93
  Top 0.61: R19.2 9.21,26.67 9.21,24.44 11.72,21.93
N$22
  Top 0.406: U2.22 12.38,19.81 12.49,19.92
  Top 0.61: R18.2 11.27,24.61 11.27,24.46 12.49,23.25 12.49,19.92
N$23
  Top 0.813: LED1.C R18.1
RX_FT232  (via drill 0.35)
  Top 0.305: U2.1 8.47,10.58 v8.89,10.16
  Top 0.406: v20.95,36.2 20.95,41.91 22.11,43.06 U1.18
  Bottom 0.406: v20.95,36.2 18.41,33.66 18.41,19.68 v8.89,10.16
TCK  (via drill 0.35)
  Top 0.406: U1.12 14.35,49.91 v13.97,49.53
  Bottom 0.406: v13.97,49.53 13.97,39.37 11.43,36.83 JP1.1
TDI
  Top 0.406: JP1.9 8.89,46.99 12.61,50.71 U1.11
TDO
  Top 0.406: JP1.3 9.69,42.71 9.69,43.02 15.77,49.11 U1.13
TMS  (via drill 0.35)
  Top 0.406: U1.10 15.31,51.51 v15.24,51.44
  Bottom 0.406: JP1.5 8.89,41.91 13.24,46.26 13.24,50.07 14.61,51.44 v15.24,51.44
TX/RX_MSE  (via drill 0.35)
  Top 0.406: U1.21 24.5,41.96 | U1.22 25.3,42.76 24.5,41.96 | 24.5,41.96 24.5,41.89 v24.36,41.75
  Bottom 0.406: v24.36,41.75 24.36,41.59 6.35,23.57 CN3.3
TX_FT232  (via drill 0.35)
  Top 0.305: U2.5 11.07,10.44 v10.16,9.53
  Top 0.406: U1.19 22.91,42.59 22.23,41.91 v22.23,36.2
  Bottom 0.406: v10.16,9.53 19.68,19.05 19.68,33.66 v22.23,36.2
USB_PWR  (1 unrouted)
  Top 0.508: 5.39,14.92 10.61,14.92 13.68,17.99 U2.20
  Top 0.61: 10.77,7.12 9.63,8.26 6.67,8.26 C31.1
  Top 0.813: 5.39,14.92 C30.1 C32.1 C31.1
VCCIO
  Top 0.406: 15.62,19.05 U2.17 15.62,17.92 | 10.43,12.56 U2.4
  Top 0.508: 16.88,22.17 C29.1 16.82,20.94 15.62,19.74 15.62,19.05
  Top 0.61: C29.1 16.82,25.3 LED1.A | 10.43,12.56 10.43,12.96 14.61,17.14 15.24,17.14 15.62,17.53 15.62,17.92
  Top 0.813: LED2.A LED1.A
XCK_MSE  (via drill 0.35)
  Top 0.406: U1.20 23.7,42.2 v23.45,41.95
  Bottom 0.406: v23.45,41.95 7.58,26.07 CN3.2
XTAL1
  Top 0.406: U1.59 25.3,68.93 Q1.2 20.64,71.12 C41.1
XTAL2
  Top 0.406: U1.58 26.11,64.46 Q1.1 34.99,73.34 C33.1